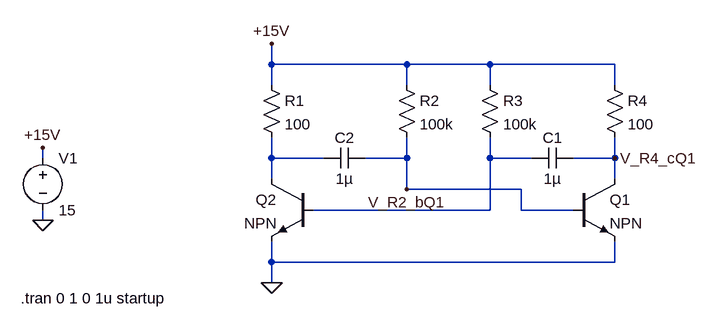
[diagram p0: schematic astable-oscillator.LTSpice.asc]
astable-oscillator.LTSpice.asc, the LTspice schematic file:
Version 4
SHEET 1 880 680
WIRE 0 -128 0 -160
WIRE 208 -128 0 -128
WIRE 336 -128 208 -128
WIRE 528 -128 336 -128
WIRE 0 -96 0 -128
WIRE 208 -96 208 -128
WIRE 336 -96 336 -128
WIRE 528 -96 528 -128
WIRE -352 16 -352 0
WIRE 0 16 0 -16
WIRE 80 16 0 16
WIRE 208 16 208 -16
WIRE 208 16 144 16
WIRE 336 16 336 -16
WIRE 400 16 336 16
WIRE 528 16 528 -16
WIRE 528 16 464 16
WIRE 0 48 0 16
WIRE 528 48 528 16
WIRE 208 64 208 16
WIRE 384 64 208 64
WIRE 336 96 336 16
WIRE 336 96 64 96
WIRE 384 96 384 64
WIRE 464 96 384 96
WIRE -352 112 -352 96
WIRE 0 176 0 144
WIRE 528 176 528 144
WIRE 528 176 0 176
WIRE 0 208 0 176
FLAG 0 208 0
FLAG 0 -160 +15V
FLAG -352 112 0
FLAG -352 0 +15V
FLAG 208 64 V_R2_bQ1
FLAG 528 16 V_R4_cQ1
SYMBOL npn 464 48 R0
SYMATTR InstName Q1
SYMBOL cap 464 0 R90
WINDOW 0 0 32 VBottom 2
WINDOW 3 32 32 VTop 2
SYMATTR InstName C1
SYMATTR Value 1µ
SYMATTR SpiceLine V=50
SYMBOL res -16 -112 R0
SYMATTR InstName R1
SYMATTR Value 100
SYMBOL res 192 -112 R0
SYMATTR InstName R2
SYMATTR Value 100k
SYMBOL res 320 -112 R0
SYMATTR InstName R3
SYMATTR Value 100k
SYMBOL res 512 -112 R0
SYMATTR InstName R4
SYMATTR Value 100
SYMBOL cap 144 0 R90
WINDOW 0 0 32 VBottom 2
WINDOW 3 32 32 VTop 2
SYMATTR InstName C2
SYMATTR Value 1µ
SYMATTR SpiceLine V=50
SYMBOL npn 64 48 M0
SYMATTR InstName Q2
SYMBOL voltage -352 0 R0
WINDOW 123 0 0 Left 0
WINDOW 39 0 0 Left 0
SYMATTR InstName V1
SYMATTR Value 15
TEXT -386 232 Left 2 !.tran 0 1 0 1u startup

The netlist it stands for:
* astable-oscillator.LTSpice.asc
Q1 V_R4_cQ1 V_R2_bQ1 0 0 NPN
C1 V_R4_cQ1 N002 1µ V=50
R1 +15V N001 100
R2 +15V V_R2_bQ1 100k
R3 +15V N002 100k
R4 +15V V_R4_cQ1 100
C2 V_R2_bQ1 N001 1µ V=50
Q2 N001 N002 0 0 NPN
V1 +15V 0 15
.model NPN NPN
.model PNP PNP
.lib standard.bjt
.tran 0 1 0 1u startup
.backanno
.end